# EAGLE design ignitor_mux (EAGLE 9.6.2)
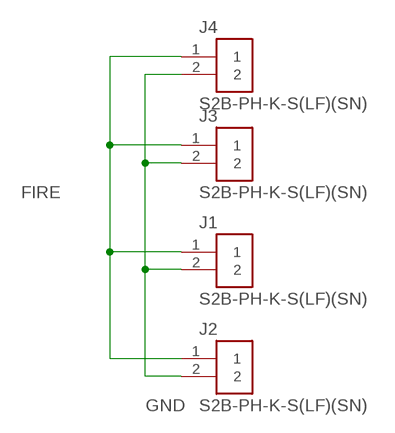
[diagram p0: schematic, sheet 1]

## Parts
J1  S2B-PH-K-S(LF)(SN)  [S2B-PH-K-S(LF)(SN)]
J2  S2B-PH-K-S(LF)(SN)  [S2B-PH-K-S(LF)(SN)]
J3  S2B-PH-K-S(LF)(SN)  [S2B-PH-K-S(LF)(SN)]
J4  S2B-PH-K-S(LF)(SN)  [S2B-PH-K-S(LF)(SN)]

## Nets
FIRE: J1.1 J2.1 J3.1 J4.1
GND: J1.2 J2.2 J3.2 J4.2

## Library data of the parts
J1-J4 = Connectors:S2B-PH-K-S(LF)(SN): CONN HEADER R/A 2POS 2MM Manufacturer's datasheet <http://www.jst-mfg.com/product/pdf/eng/ePH.pdf>; CREATED_BY: PCBLayout.com; DIGI_KEY_PART_NUMBER: 455-1719-ND; MANUFACTURER: JST Sales America Inc.; MPN: S2B-PH-K-S(LF)(SN)

## Board
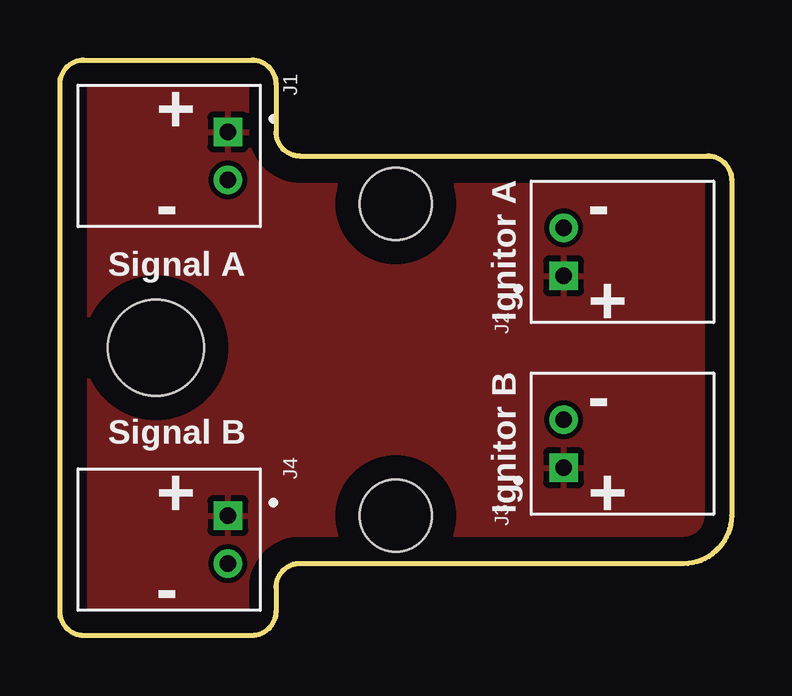
[diagram p1: board, top side]
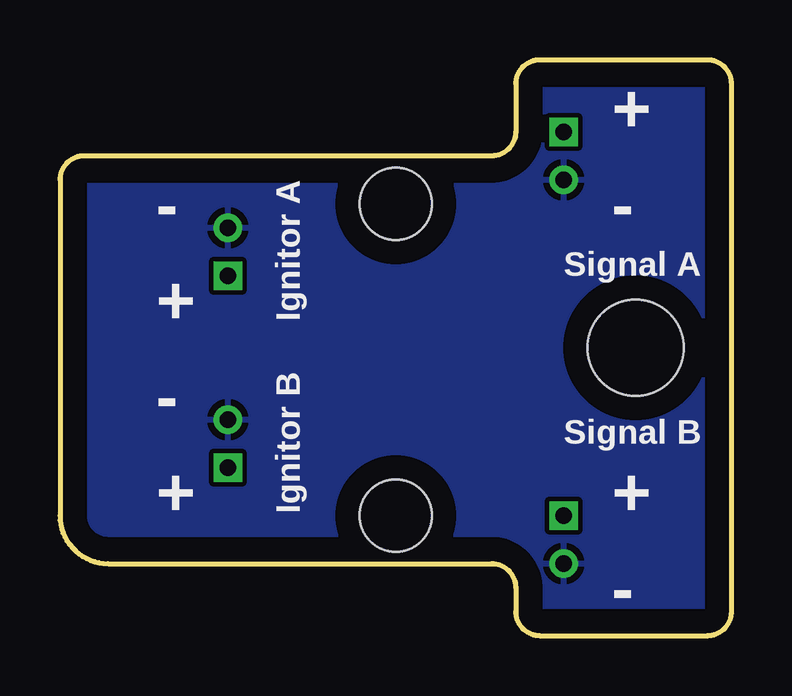
[diagram p2: board, bottom side, seen from below]

Size 28 x 24 mm. Coordinates in mm from the lower left corner, seen from the top.
Outline: 1,24 8,24 arc-90 9,23 9,21 arc90 10,20 27,20 arc-90 28,19 28,5 arc-90 26,3 10,3 arc90 9,2 9,1 arc-90 8,0 1,0 arc-90 0,1 0,23 arc-90 1,24
Copper layers (1*16): Top 0.035mm / dielectric 1.5mm / Bottom 0.035mm
Design rules "default": minimum track width 6mil, minimum drill 0.35mm, track to track 6mil, track to pad 6mil, pad to pad 6mil, via to via 6mil, smd to smd 6mil, copper to edge 40mil, drill to drill 6mil, minimum pad ring 10mil, minimum via ring 8mil, stop-mask expansion 4mil, vias tented up to drill 0mil, thermal gap 10mil
Holes 4 mm at 4,12
Holes 3 mm at 14,18 14,5

### Footprints (pad centres in the part's own frame; a part is rotated, then mirrored left to right if it is on the bottom)
S2B-PH-K-S(LF)(SN) = drill 0.7 square: 1 -1,0 | drill 0.7: 2 1,0

### Placement (x,y rotation side)
J1  7,20 270 top
J2  21,16 90 top
J3  21,8 90 top
J4  7,4 270 top

### Tracks (layer width: path | path; a pad name or v marks a point on that pad's centre or on a via)
FIRE
  pour Top (isolate 0.2): -1,25 29,25 29,-1 -1,-1
GND
  pour Bottom (isolate 0.2): -4,26 30,26 30,-2 -3,-2 -4,-2

### Text on the board
tPlace: + | Ignitor A | - | - | Signal A | + | Ignitor B | - | Signal B | + | + | -
bPlace: + | Ignitor A | - | - | Signal A | + | Ignitor B | - | Signal B | + | + | -